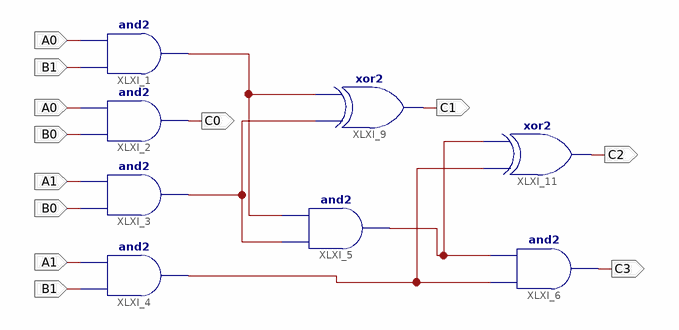
[diagram p0: schematic sheet 1]
// Xilinx ISE schematic Multiplier2x2.sch (spartan3e) as structural Verilog: 8 symbols, 8 ports
module Multiplier2x2 (
  input  A0,
  input  B1,
  input  A1,
  input  B0,
  output C0,
  output C1,
  output C2,
  output C3
);

  wire XLXN_11, XLXN_13, XLXN_16, XLXN_17;

  and XLXI_1 (XLXN_11, B1, A0);
  and XLXI_2 (C0, B0, A0);
  and XLXI_3 (XLXN_13, B0, A1);
  and XLXI_4 (XLXN_16, B1, A1);
  and XLXI_5 (XLXN_17, XLXN_13, XLXN_11);
  and XLXI_6 (C3, XLXN_16, XLXN_17);
  xor XLXI_9 (C1, XLXN_13, XLXN_11);
  xor XLXI_11 (C2, XLXN_16, XLXN_17);
endmodule
